# Altium schematic sheet Mainboard.SchDoc
size A4
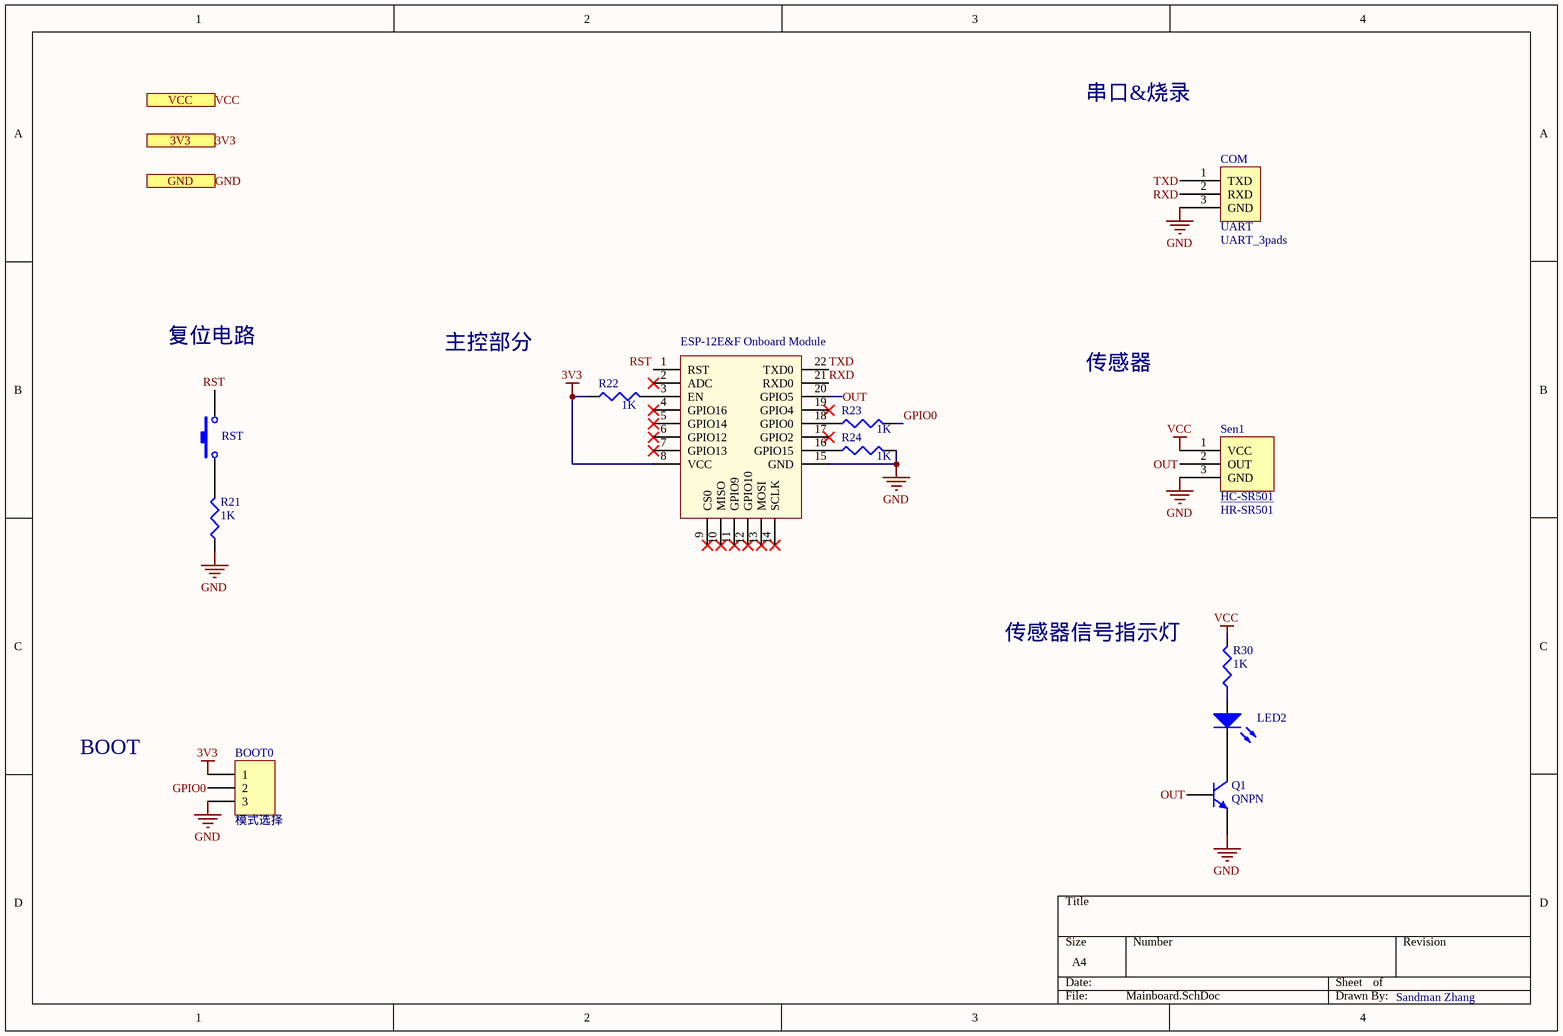
[diagram p0: Mainboard.SchDoc]

## Parts
BOOT0  模式选择  [HDR1X3]
COM  UART_3pads  [3pads]
LED2  LED3  [6-0805_N]  (value not drawn)
Q1  QNPN  [SOT-23B_N]
R21  value 1K  [J1-0603]  (hidden comment: Res3)
R22  value 1K  [J1-0603]  (hidden comment: Res3)
R23  value 1K  [J1-0603]  (hidden comment: Res3)
R24  value 1K  [J1-0603]  (hidden comment: Res3)
R30  value 1K  [6-0805_N]  (hidden comment: Res3)
RST  SW-PB  [SPST-2]  (value not drawn)
Sen1  HR-SR501  [HR-SR501]
U1  ESP-12E&F Onboard Module  [ESP-12E&F Module]

## Ports
3V3, GND, VCC

## Nets
3V3: BOOT0.1 R22.1 U1.8(VCC) ; port 3V3
GND: BOOT0.3 COM.3(GND) Q1.3(E) R21.1 R24.2 Sen1.3(GND) U1.15(GND) ; port GND
VCC: R30.2 Sen1.1(VCC) ; port VCC
GPIO0: BOOT0.2 R23.2
OUT: Q1.2(B) Sen1.2(OUT) U1.20(GPIO5)
RST: RST.2 U1.1(RST)
RXD: COM.2(RXD) U1.21(RXD0)
TXD: COM.1(TXD) U1.22(TXD0)
NetLED2_1: LED2.1(A) R30.1
NetLED2_2: LED2.2(K) Q1.1(C)
NetR21_2: R21.2 RST.1
NetR22_2: R22.2 U1.3(EN)
NetR23_1: R23.1 U1.18(GPIO0)
NetR24_1: R24.1 U1.16(GPIO15)

Not connected (* = marked no-connect by the designer): U1 2(ADC)* 4(GPIO16)* 5(GPIO14)* 6(GPIO12)* 7(GPIO13)* 9(CS0)* 10(MISO)* 11(GPIO9)* 12(GPIO10)* 13(MOSI)* 14(SCLK)* 17(GPIO2)* 19(GPIO4)*

## Notes on the sheet
- 串口&烧录
- 复位电路
- 主控部分
- 传感器
- 传感器信号指示灯
- BOOT
- Sandman Zhang
- (in symbol HR-SR501) HC-SR501
- (in symbol UART_3pads) UART

## Library data of the parts
BOOT0 = Header 3: Header, 3-Pin; LatestRevisionDate: 17-Jul-2002; LatestRevisionNote: Re-released for DXP Platform.; Publisher: Altium Limited
LED2 = LED3: Typical BLUE SiC LED; Published: 8-Jun-2000; LatestRevisionDate: 17-Dec-2003; LatestRevisionNote: PCB Footprint replaced.; DatasheetVersion: 16-Apr-2002; PackageVersion: 16-Apr-2002; PackageReference: 3.5X2.8X1.9; Publisher: Altium Limited; PackageDescription: SM LED; 2 C-Bend Leads; Body 3.5 x 2.8 x 1.9 mm, inc leads (LxWxH typ)
Q1 = QNPN: NPN Bipolar Transistor; Published: 8-Jun-2000; LatestRevisionDate: 29-May-2009; LatestRevisionNote: IPC-7351 Footprint Added.; PackageVersion: Aug-1999; PackageReference: SOT-23B; Publisher: Altium Limited; PackageDescription: 3-Pin SOT-23 Package 0.95 mm Pitch, 2.4 mm Lead Span
R21-R24 R30 = Res3: Resistor; Published: 8-Jun-2000; LatestRevisionDate: 29-May-2009; LatestRevisionNote: IPC-7351 Footprint Added.; PackageReference: J1-0603; Publisher: Altium Limited; PackageDescription: Chip Resistor
RST = SW-PB: Switch; Published: 24-Mar-1999; LatestRevisionDate: 17-Jul-2002; LatestRevisionNote: Re-released for DXP Platform.; PackageReference: SPST-2; Publisher: Altium Limited; PackageDescription: Switch; 2 Leads
Sen1 = HR-SR501: 人体红外感应模块